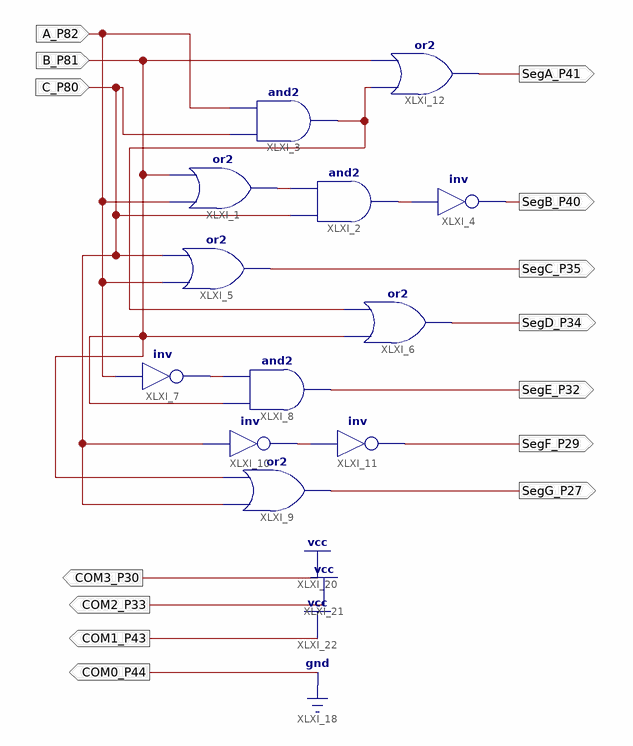
[diagram p0: schematic sheet 1]
// Xilinx ISE schematic Segment.sch (spartan6) as structural Verilog: 12 symbols, 14 ports
module Segment (
  input  B_P81,
  input  A_P82,
  input  C_P80,
  output SegB_P40,
  output SegC_P35,
  output SegA_P41,
  output SegD_P34,
  output SegE_P32,
  output SegG_P27,
  output SegF_P29,
  output COM3_P30,
  output COM1_P43,
  output COM0_P44,
  output COM2_P33
);

  wire XLXN_1, XLXN_16, XLXN_25, XLXN_35, XLXN_40;

  or XLXI_1 (XLXN_1, A_P82, B_P81);
  and XLXI_2 (XLXN_25, C_P80, XLXN_1);
  and XLXI_3 (XLXN_16, C_P80, A_P82);
  not XLXI_4 (SegB_P40, XLXN_25);
  or XLXI_5 (SegC_P35, A_P82, C_P80);
  or XLXI_6 (SegD_P34, B_P81, XLXN_16);
  not XLXI_7 (XLXN_35, A_P82);
  and XLXI_8 (SegE_P32, B_P81, XLXN_35);
  or XLXI_9 (SegG_P27, C_P80, B_P81);
  not XLXI_10 (XLXN_40, C_P80);
  not XLXI_11 (SegF_P29, XLXN_40);
  or XLXI_12 (SegA_P41, XLXN_16, B_P81);

  assign COM0_P44 = 1'b0;
  assign COM1_P43 = 1'b1;
  assign COM2_P33 = 1'b1;
  assign COM3_P30 = 1'b1;
endmodule
